# Altium schematic sheet Ring 4.SchDoc
size A; SheetNumber: 17; SheetTotal: 30
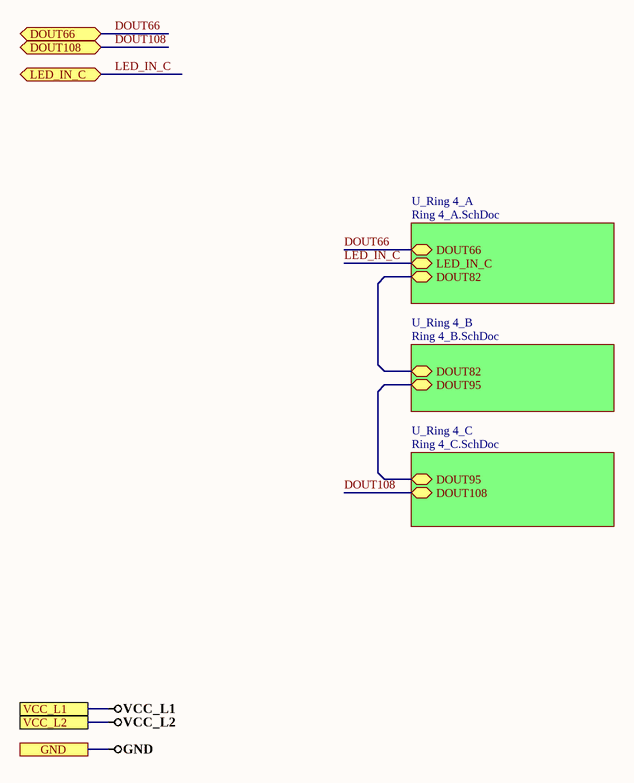
[diagram p0: Ring 4.SchDoc]

## Sub-sheets
U_Ring 4_A = Ring 4_A.SchDoc: DOUT66 (bidir), DOUT82 (bidir), LED_IN_C (bidir)
U_Ring 4_B = Ring 4_B.SchDoc: DOUT82 (bidir), DOUT95 (bidir)
U_Ring 4_C = Ring 4_C.SchDoc: DOUT95 (bidir), DOUT108 (bidir)

## Ports
DOUT66 (bidir), DOUT108 (bidir), GND, LED_IN_C (bidir), VCC_L1, VCC_L2

## Nets
GND: port GND
VCC_L1: port VCC_L1
VCC_L2: port VCC_L2
DOUT66: port DOUT66, sheet U_Ring 4_A/DOUT66
DOUT108: port DOUT108, sheet U_Ring 4_C/DOUT108
LED_IN_C: port LED_IN_C, sheet U_Ring 4_A/LED_IN_C
(unnamed): sheet U_Ring 4_A/DOUT82, sheet U_Ring 4_B/DOUT82
(unnamed): sheet U_Ring 4_B/DOUT95, sheet U_Ring 4_C/DOUT95